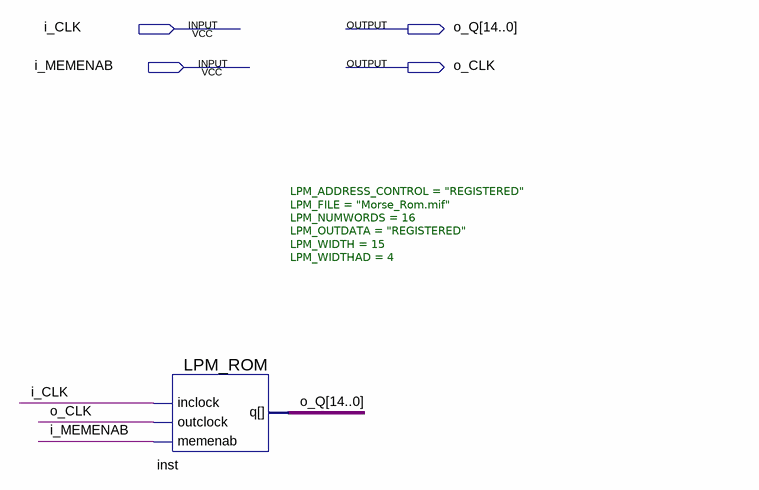
[diagram p0: schematic sheet]
// Quartus schematic Morse_Rom.bdf as structural Verilog: 1 symbols, 4 pins
module Morse_Rom (
  input  i_CLK,
  input  i_MEMENAB,
  output [14:0] o_Q,
  output o_CLK
);

  LPM_ROM #(.LPM_ADDRESS_CONTROL("REGISTERED"), .LPM_FILE("Morse_Rom.mif"), .LPM_NUMWORDS(16), .LPM_OUTDATA("REGISTERED"), .LPM_WIDTH(15), .LPM_WIDTHAD(4)) inst (
    .inclock(i_CLK), .memenab(i_MEMENAB), .outclock(o_CLK), .q(o_Q));
endmodule
